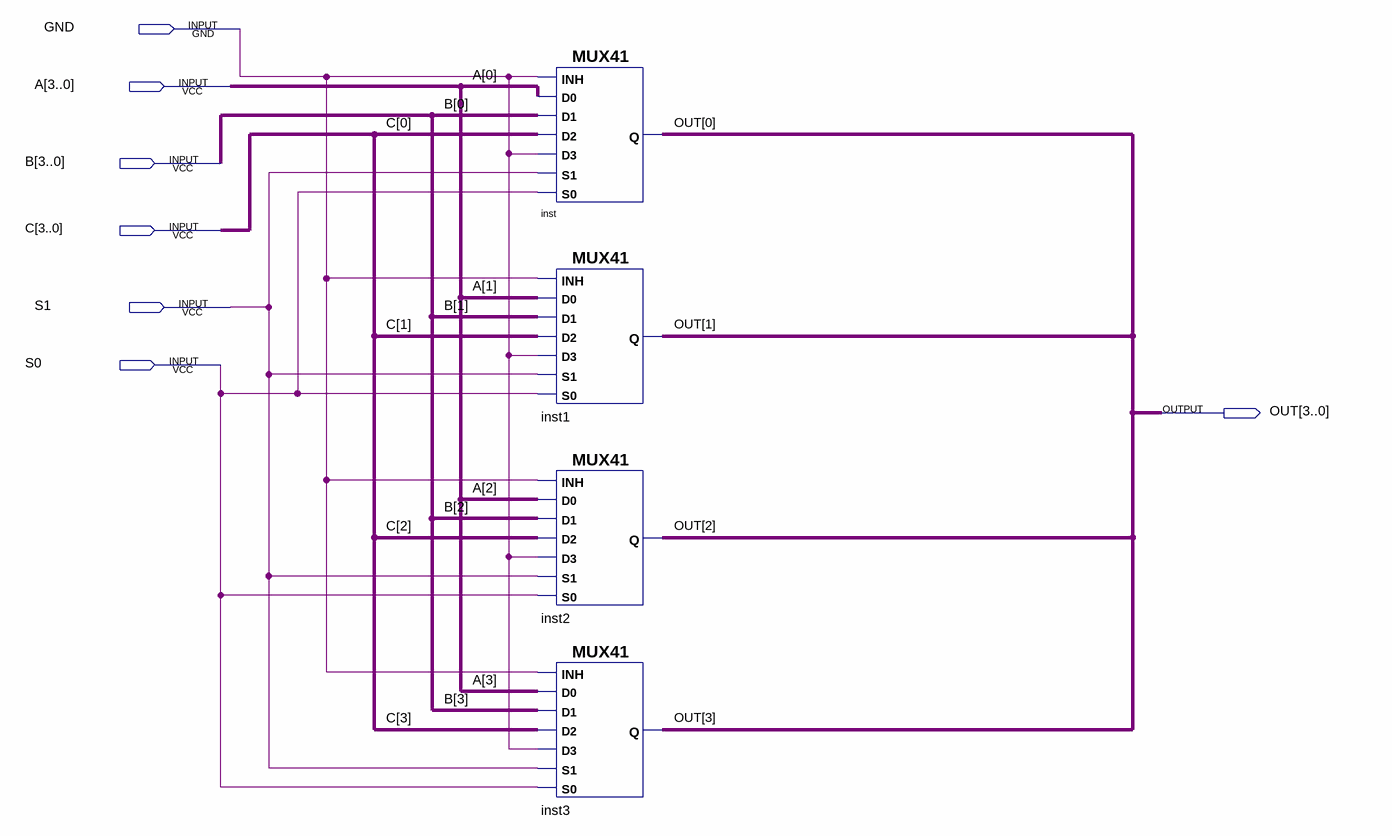
[diagram p0: schematic sheet]
// Quartus schematic SELECTOR.bdf as structural Verilog: 4 symbols, 7 pins
module SELECTOR (
  input  GND,
  input  [3:0] A,
  input  [3:0] B,
  input  [3:0] C,
  input  S1,
  input  S0,
  output [3:0] OUT
);

  MUX41 inst (.S0(S0), .D2(C[0]), .S1(S1), .D3(GND), .D0(A[0]), .INH(GND), .D1(B[0]), .Q(OUT[0]));
  MUX41 inst1 (.S0(S0), .D2(C[1]), .S1(S1), .D3(GND), .D0(A[1]), .INH(GND), .D1(B[1]), .Q(OUT[1]));
  MUX41 inst2 (.S0(S0), .D2(C[2]), .S1(S1), .D3(GND), .D0(A[2]), .INH(GND), .D1(B[2]), .Q(OUT[2]));
  MUX41 inst3 (.S0(S0), .D2(C[3]), .S1(S1), .D3(GND), .D0(A[3]), .INH(GND), .D1(B[3]), .Q(OUT[3]));
endmodule
